# EAGLE design Cumulative_Testing_PCB1_01_Shreya (EAGLE 9.6.2)
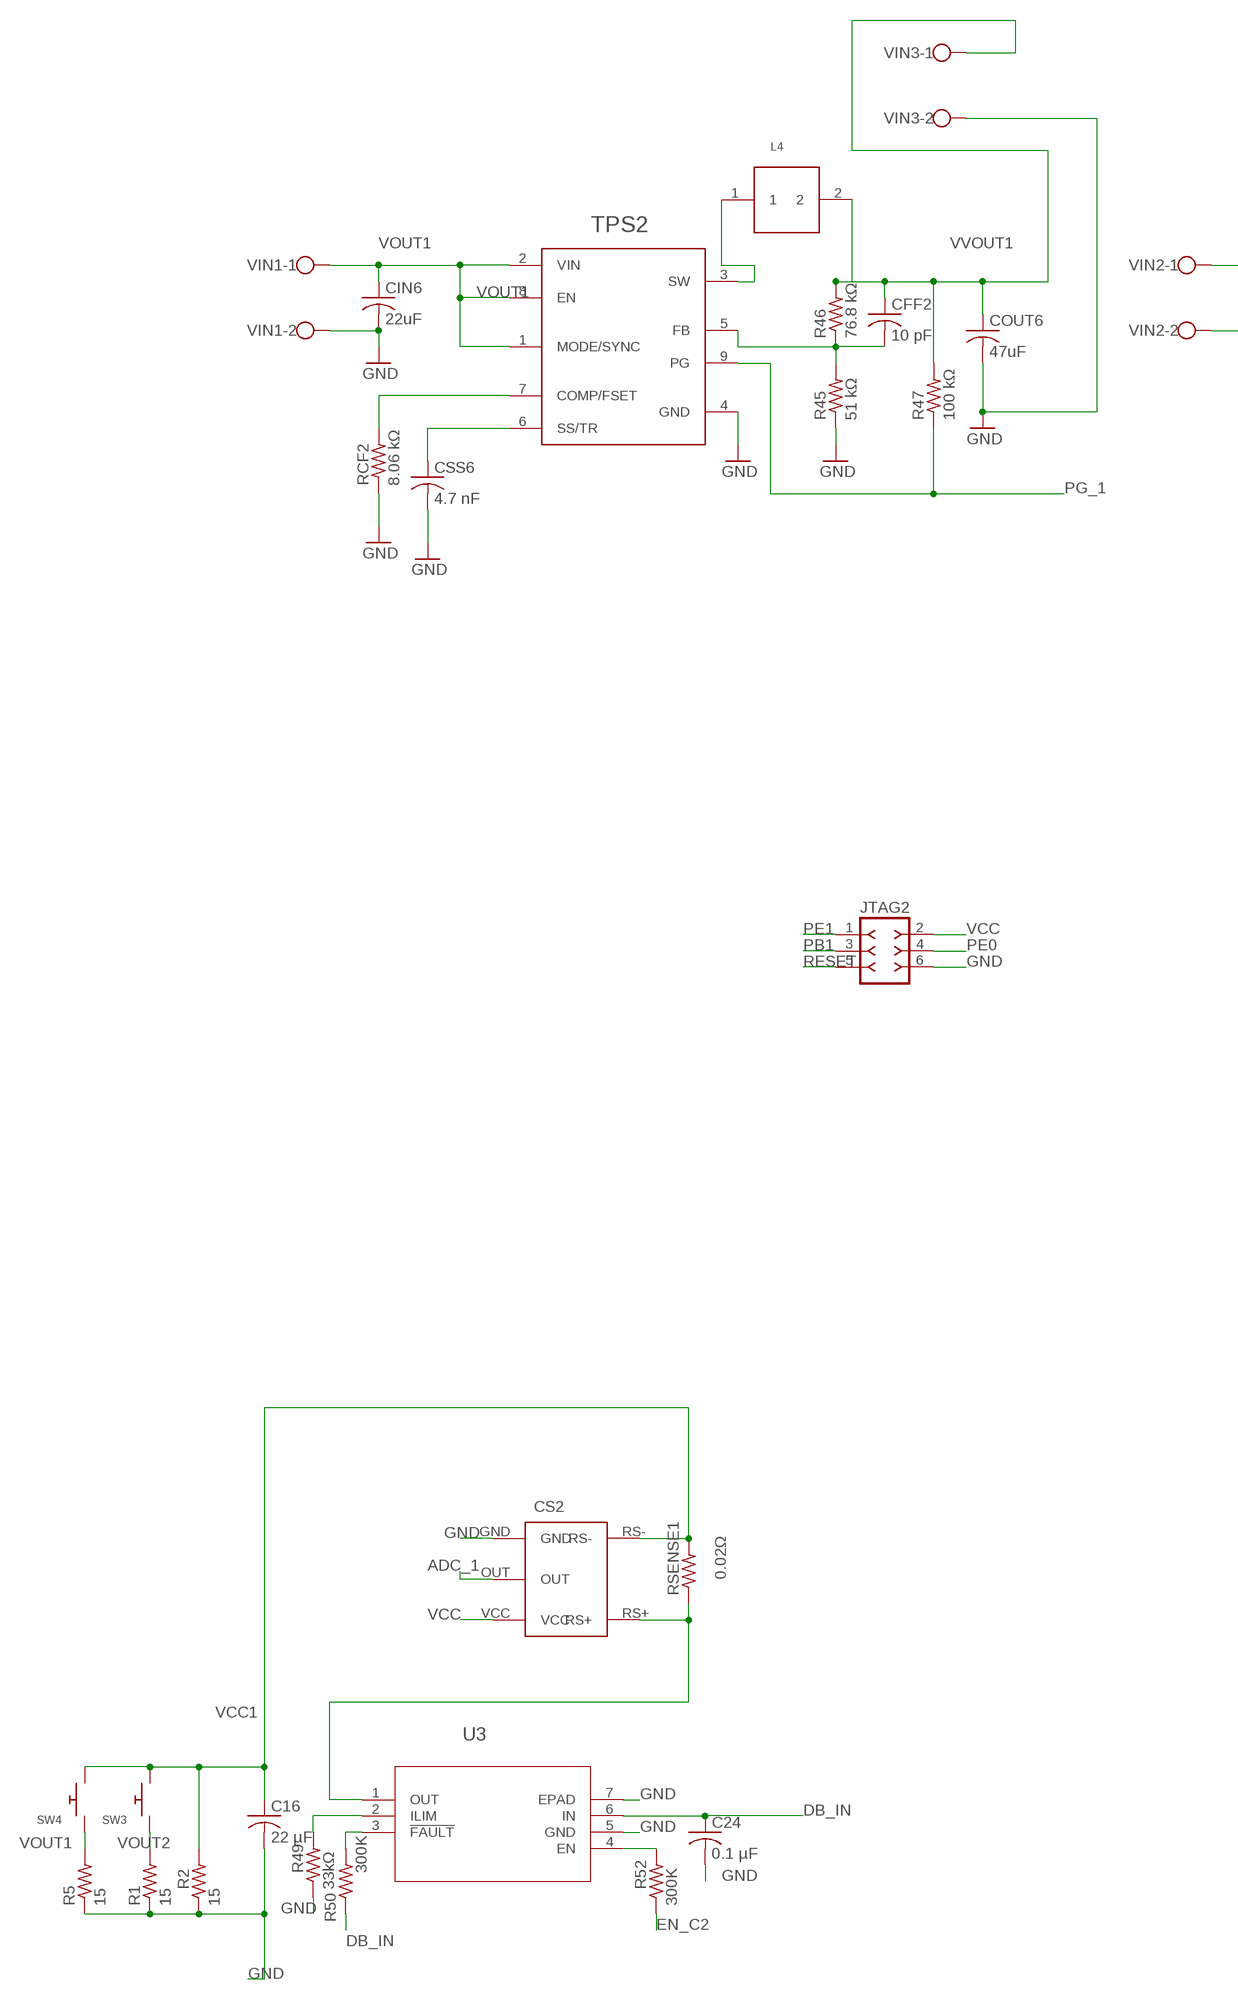
[diagram p0: schematic, sheet 1, part 1 of 2]
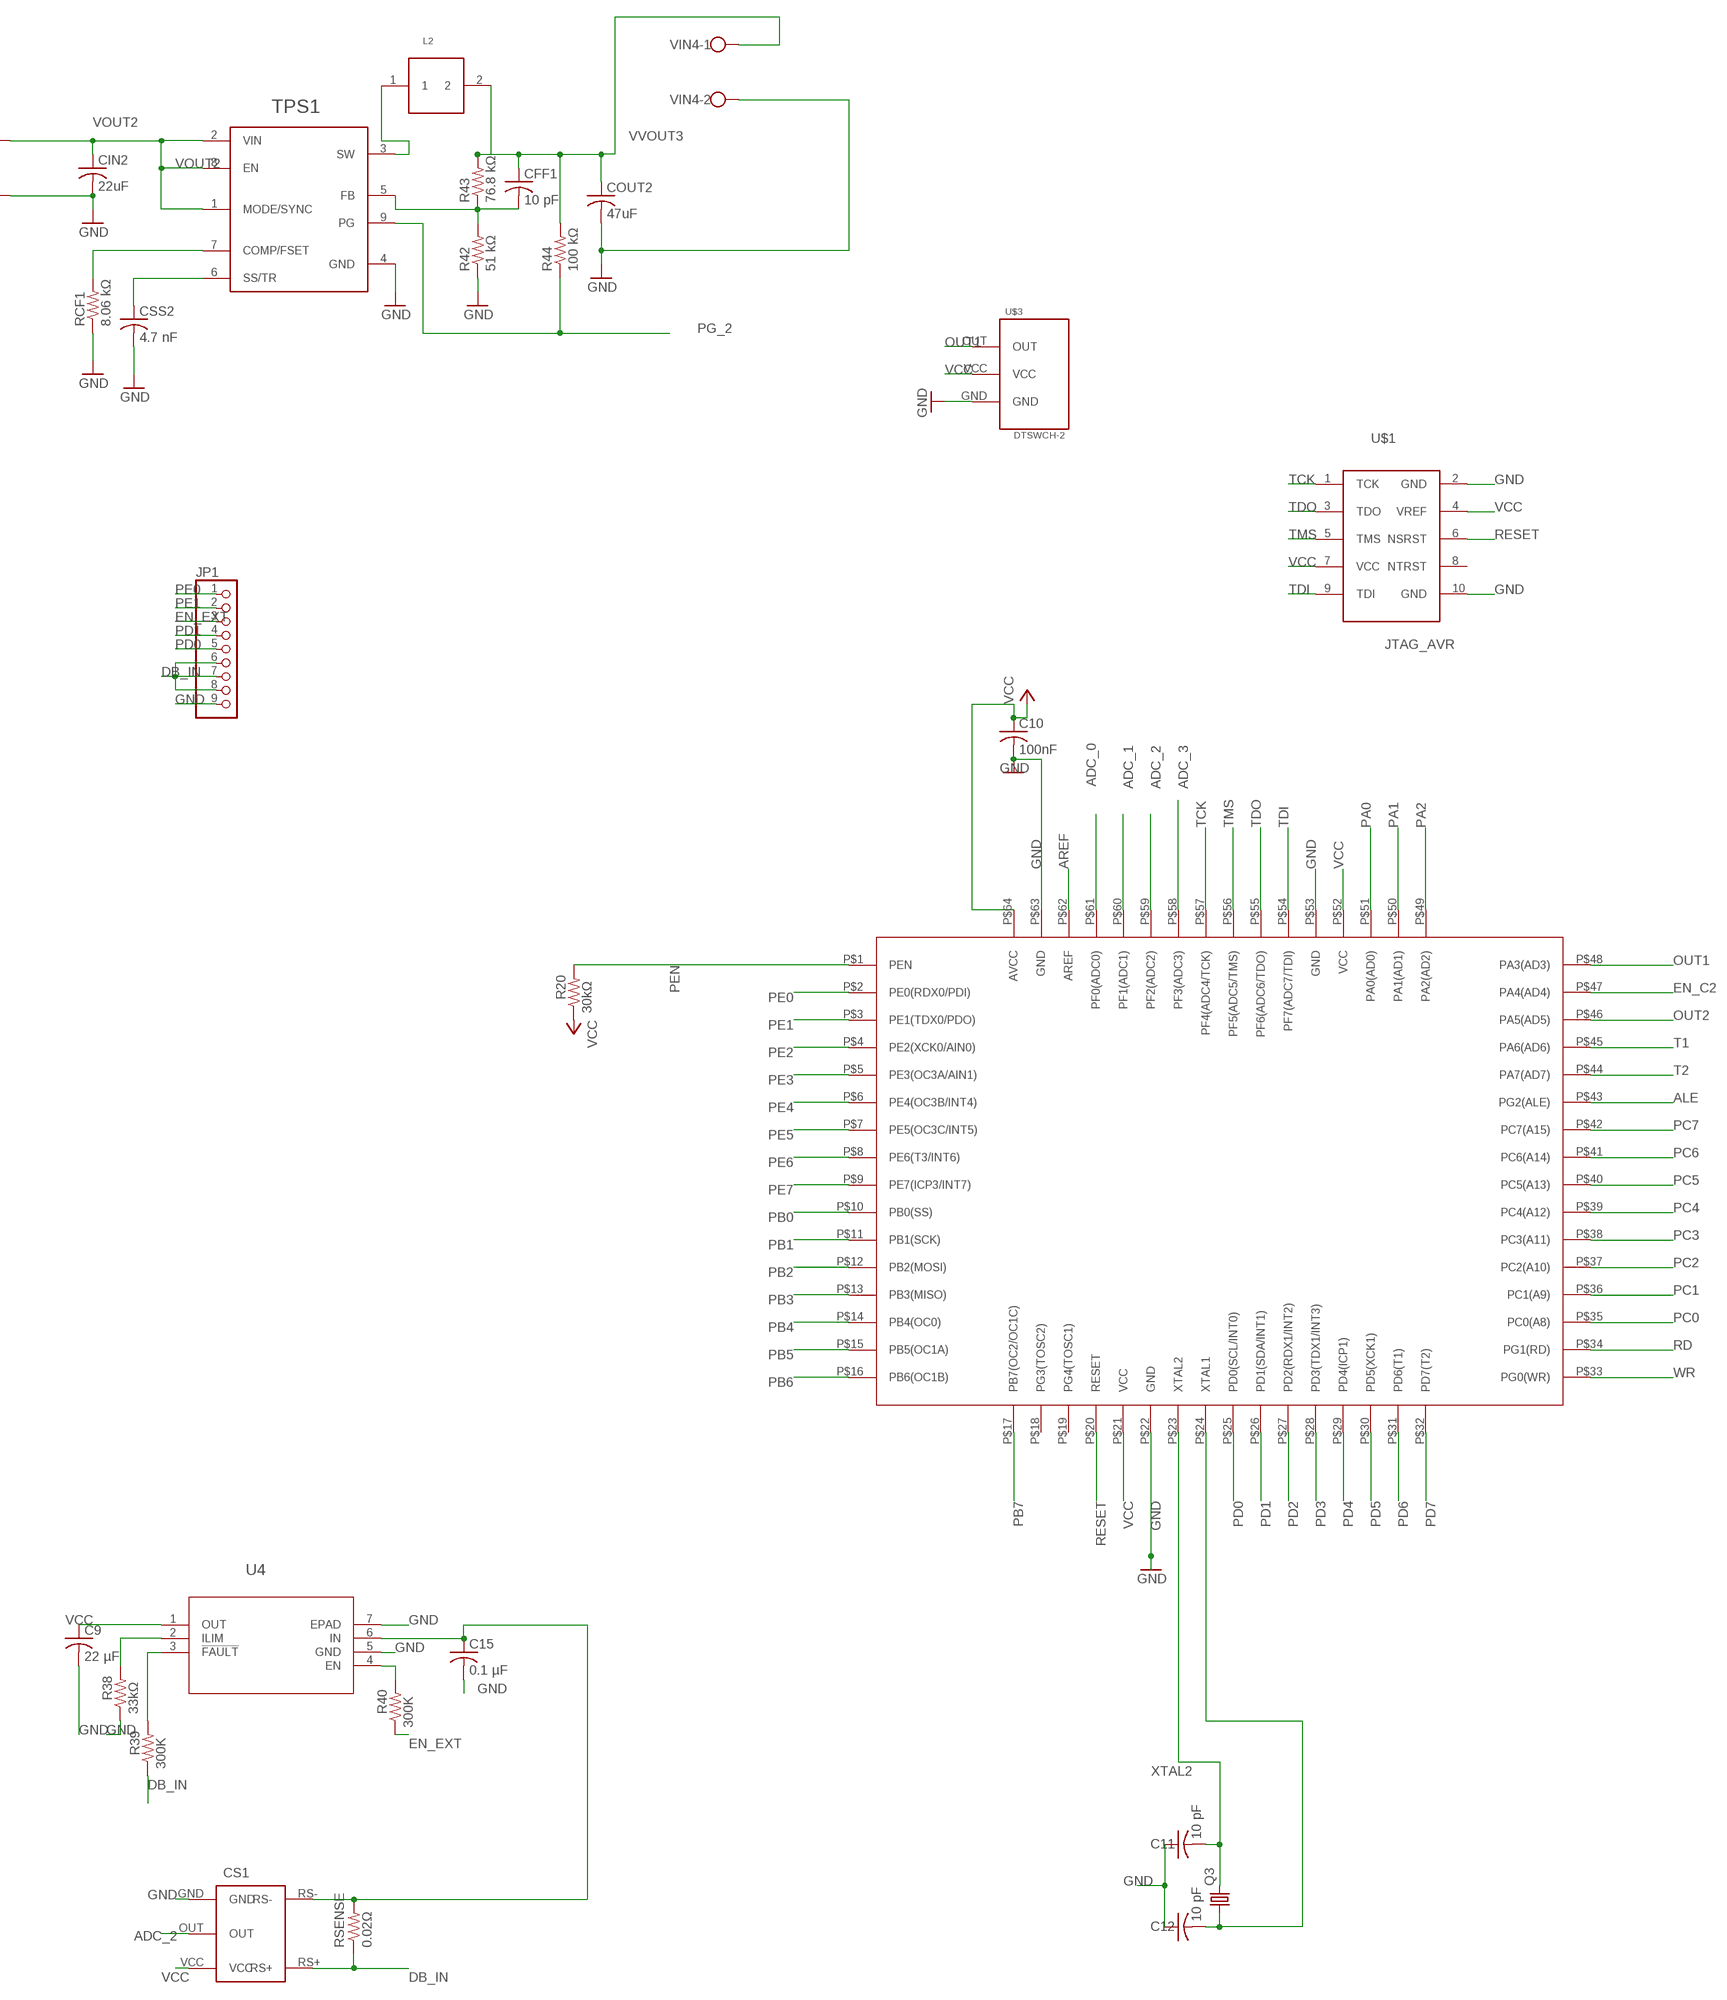
[diagram p1: schematic, sheet 1, part 2 of 2]

## Parts
ATMEGA128  ATMEGAS128  [ATMEGAS128]
C9  22 µF  C-USC0805  [C0805]
C10  100nF  C-USC0805  [C0805]
C11  10 pF  C-USC0805  [C0805]
C12  10 pF  C-USC0805  [C0805]
C15  0.1 µF  C-USC0805  [C0805]
C16  22 µF  C-USC0805  [C0805]
C24  0.1 µF  C-USC0805  [C0805]
CFF1  10 pF  C-USC0805  [C0805]
CFF2  10 pF  C-USC0805  [C0805]
CIN2  22uF  C-USC0805  [C0805]
CIN6  22uF  C-USC0805  [C0805]
COUT2  47uF  C-USC0805  [C0805]
COUT6  47uF  C-USC0805  [C0805]
CS1  MAX4372T  [MAX4372T]
CS2  MAX4372T  [MAX4372T]
CSS2  4.7 nF  C-USC0805  [C0805]
CSS6  4.7 nF  C-USC0805  [C0805]
JP1  PINHD-1X9  [1X09-BIG]
JTAG2  F-2X03-DIL-100  [DIL-100-2X03]
L2  0.56uH  XEL4020-561MEB  [XEL4020-561MEB]
L4  0.56uH  XEL4020-561MEB  [XEL4020-561MEB]
Q3  CRYSTALHC49U-V  [HC49U-V]
R1  15  R-US_R0805  [R0805]
R2  15  R-US_R0805  [R0805]
R5  15  R-US_R0805  [R0805]
R20  30kΩ  R-US_R0805  [R0805]
R38  33kΩ  R-US_R0805  [R0805]
R39  300K  R-US_R0805  [R0805]
R40  300K  R-US_R0805  [R0805]
R42  51 kΩ  R-US_R0805  [R0805]
R43  76.8 kΩ  R-US_R0805  [R0805]
R44  100 kΩ  R-US_R0805  [R0805]
R45  51 kΩ  R-US_R0805  [R0805]
R46  76.8 kΩ  R-US_R0805  [R0805]
R47  100 kΩ  R-US_R0805  [R0805]
R49  33kΩ  R-US_R0805  [R0805]
R50  300K  R-US_R0805  [R0805]
R52  300K  R-US_R0805  [R0805]
RCF1  8.06 kΩ  R-US_R0805  [R0805]
RCF2  8.06 kΩ  R-US_R0805  [R0805]
RSENSE  0.02Ω  R-US_R0805  [R0805]
RSENSE1  0.02Ω  R-US_R0805  [R0805]
SW3  SWITCH_PUSHBUTTONC&K_KSS  [BTN_CK_KSS]
SW4  SWITCH_PUSHBUTTONC&K_KSS  [BTN_CK_KSS]
TPS1  TPS62812  [TPS62812]
TPS2  TPS62812  [TPS62812]
U3  TPS25200DRVT_CURR_LIMIT  [DRV6_1X1P6]
U4  TPS25200DRVT_CURR_LIMIT  [DRV6_1X1P6]
U$1  JTAG_AVR  [JTAG_AVR]
U$3  DTSWCH-2  [DTSWCH-2]
VIN1  W237-102  [W237-102]
VIN2  W237-102  [W237-102]
VIN3  W237-102  [W237-102]
VIN4  W237-102  [W237-102]

## Nets
ADC_0: ATMEGA128.P$61(PF0(ADC0))
ADC_1: ATMEGA128.P$60(PF1(ADC1)) CS2.OUT
ADC_2: ATMEGA128.P$59(PF2(ADC2)) CS1.OUT
ADC_3: ATMEGA128.P$58(PF3(ADC3))
ALE: ATMEGA128.P$43(PG2(ALE))
AREF: ATMEGA128.P$62(AREF)
DB_IN: C24.1 CS1.RS+ JP1.6 JP1.7 JP1.8 R39.1 R50.1 RSENSE.1 U3.6(IN)
EN_C2: ATMEGA128.P$47(PA4(AD4)) R52.1
EN_EXT: JP1.3 R40.1
GND: ATMEGA128.P$22(GND) ATMEGA128.P$53(GND) ATMEGA128.P$63(GND) C9.2 C10.2 C11.1 C12.1 C15.2 C16.2 C24.2 CIN2.2 CIN6.2 COUT2.2 COUT6.2 CS1.GND CS2.GND CSS2.2 CSS6.2 JP1.9 JTAG2.6 R1.1 R2.1 R5.1 R38.1 R42.1 R45.1 R49.1 RCF1.1 RCF2.1 TPS1.4(GND) TPS2.4(GND) U3.5(GND) U3.7(EPAD) U4.5(GND) U4.7(EPAD) U$1.2(GND) U$1.10(GND) U$3.GND VIN1.2 VIN2.2 VIN3.2 VIN4.2
N$5: C15.1 CS1.RS- RSENSE.2 U4.6(IN)
N$6: CS2.RS+ RSENSE1.1 U3.1(OUT)
N$31: ATMEGA128.P$24(XTAL1) C12.2 Q3.1
N$70: CFF1.2 R42.2 R43.1 TPS1.5(FB)
N$71: L2.1 TPS1.3(SW)
N$72: RCF1.2 TPS1.7(COMP/FSET)
N$73: CSS2.1 TPS1.6(SS/TR)
N$74: CFF2.2 R45.2 R46.1 TPS2.5(FB)
N$75: L4.1 TPS2.3(SW)
N$76: RCF2.2 TPS2.7(COMP/FSET)
N$77: CSS6.1 TPS2.6(SS/TR)
N$102: R49.2 U3.2(ILIM)
N$103: R50.2 U3.3(!FAULT)
N$104: R52.2 U3.4(EN)
N$105: R38.2 U4.2(ILIM)
N$106: R40.2 U4.4(EN)
N$107: R39.2 U4.3(!FAULT)
OUT1: ATMEGA128.P$48(PA3(AD3)) U$3.OUT
OUT2: ATMEGA128.P$46(PA5(AD5))
PA0: ATMEGA128.P$51(PA0(AD0))
PA1: ATMEGA128.P$50(PA1(AD1))
PA2: ATMEGA128.P$49(PA2(AD2))
PB0: ATMEGA128.P$10(PB0(SS))
PB1: ATMEGA128.P$11(PB1(SCK)) JTAG2.3
PB2: ATMEGA128.P$12(PB2(MOSI))
PB3: ATMEGA128.P$13(PB3(MISO))
PB4: ATMEGA128.P$14(PB4(OC0))
PB5: ATMEGA128.P$15(PB5(OC1A))
PB6: ATMEGA128.P$16(PB6(OC1B))
PB7: ATMEGA128.P$17(PB7(OC2/OC1C))
PC0: ATMEGA128.P$35(PC0(A8))
PC1: ATMEGA128.P$36(PC1(A9))
PC2: ATMEGA128.P$37(PC2(A10))
PC3: ATMEGA128.P$38(PC3(A11))
PC4: ATMEGA128.P$39(PC4(A12))
PC5: ATMEGA128.P$40(PC5(A13))
PC6: ATMEGA128.P$41(PC6(A14))
PC7: ATMEGA128.P$42(PC7(A15))
PD0: ATMEGA128.P$25(PD0(SCL/INT0)) JP1.5
PD1: ATMEGA128.P$26(PD1(SDA/INT1)) JP1.4
PD2: ATMEGA128.P$27(PD2(RDX1/INT2))
PD3: ATMEGA128.P$28(PD3(TDX1/INT3))
PD4: ATMEGA128.P$29(PD4(ICP1))
PD5: ATMEGA128.P$30(PD5(XCK1))
PD6: ATMEGA128.P$31(PD6(T1))
PD7: ATMEGA128.P$32(PD7(T2))
PE0: ATMEGA128.P$2(PE0(RDX0/PDI)) JP1.1 JTAG2.4
PE1: ATMEGA128.P$3(PE1(TDX0/PDO)) JP1.2 JTAG2.1
PE2: ATMEGA128.P$4(PE2(XCK0/AIN0))
PE3: ATMEGA128.P$5(PE3(OC3A/AIN1))
PE4: ATMEGA128.P$6(PE4(OC3B/INT4))
PE5: ATMEGA128.P$7(PE5(OC3C/INT5))
PE6: ATMEGA128.P$8(PE6(T3/INT6))
PE7: ATMEGA128.P$9(PE7(ICP3/INT7))
PEN: ATMEGA128.P$1(PEN) R20.2
PG_1: R47.1 TPS2.9(PG)
PG_2: R44.1 TPS1.9(PG)
RD: ATMEGA128.P$34(PG1(RD))
RESET: ATMEGA128.P$20(RESET) JTAG2.5 U$1.6(NSRST)
T1: ATMEGA128.P$45(PA6(AD6))
T2: ATMEGA128.P$44(PA7(AD7))
TCK: ATMEGA128.P$57(PF4(ADC4/TCK)) U$1.1(TCK)
TDI: ATMEGA128.P$54(PF7(ADC7/TDI)) U$1.9(TDI)
TDO: ATMEGA128.P$55(PF6(ADC6/TDO)) U$1.3(TDO)
TMS: ATMEGA128.P$56(PF5(ADC5/TMS)) U$1.5(TMS)
VCC: ATMEGA128.P$21(VCC) ATMEGA128.P$52(VCC) ATMEGA128.P$64(AVCC) C9.1 C10.1 CS1.VCC CS2.VCC JTAG2.2 R20.1 U4.1(OUT) U$1.4(VREF) U$1.7(VCC) U$3.VCC
VCC1: C16.1 CS2.RS- R2.2 RSENSE1.2 SW3.P$2 SW4.P$2
VOUT1: CIN6.1 R5.2 SW4.P$1 TPS2.1(MODE/SYNC) TPS2.2(VIN) TPS2.8(EN) VIN1.1
VOUT2: CIN2.1 R1.2 SW3.P$1 TPS1.1(MODE/SYNC) TPS1.2(VIN) TPS1.8(EN)
VOUT3: VIN2.1
VVOUT1: CFF2.1 COUT6.1 L4.2 R46.2 R47.2 VIN3.1
VVOUT3: CFF1.1 COUT2.1 L2.2 R43.2 R44.2 VIN4.1
WR: ATMEGA128.P$33(PG0(WR))
XTAL2: ATMEGA128.P$23(XTAL2) C11.2 Q3.2
Unconnected: ATMEGA128.P$18(PG3(TOSC2)) ATMEGA128.P$19(PG4(TOSC1)) U$1.8(NTRST)

## Library data of the parts
ATMEGA128 = AtxMegaS128:ATMEGAS128
C9-C12 C15 C16 C24 = adafruit:C-US: CAPACITOR, American symbol
CFF1 CFF2 CIN2 CIN6 COUT2 COUT6 CSS2 CSS6 = rcl:C-US: CAPACITOR, American symbol; SPICEPREFIX: C
CS1 CS2 = ADS_comp:MAX4372T
JP1 = adafruit:PINHD-1X9: Pin header 1x10 0.1" spacing With round pins
JTAG2 = con-headers-jp:F-2X03-: FEMALE HEADER
L2 L4 = XEL4020-561MEB (INDUCTOR):XEL4020-561MEB: Shielded Power Inductor XEL4020 • Extremely low DCR and ultra low AC losses for high switching frequencies (2 to 5 MHz) • AEC-Q200 Grade 1 qualified (–40°C to +125°C ambient) • Superior current handling with soft saturation characteristics • Can withstand high current spike
Q3 = crystal:CRYSTAL: CRYSTAL; OC_FARNELL: 1666969; OC_NEWARK: unknown
R1 R2 R5 R20 R38-R40 R42-R47 R49 R50 R52 RCF1 RCF2 RSENSE RSENSE1 = adafruit:R-US_: RESISTOR, American symbol
SW3 SW4 = adafruit:SWITCH_PUSHBUTTON: Buttons SOFTTOUCHSMD_SJ - Soft touch temporary push button (Super Junk Akihabara) Compatible with SKPMANE010 [Mouser: 688-SKPMAN] C&K_KSS = Digikey: KSS221GLFS
TPS1 TPS2 = TPS62812:TPS62812: TPS6281x-Q1 2.75-V to 6-V Adjustable-Frequency Step-Down Converter 1. Features • AEC-Q100 qualified for automotive applications – Device temperature grade 1: –40°C to +125°C TA • Input voltage range: 2.75 V to 6 V • Family of 1 A, 2 A, 3 A and 4 A • Quiescent current 15-µA typical • Output voltage from 0.6 V to 5.5 V • Output voltage accuracy ±1% (PWM operation) • Adjustable soft-start • Forced PWM or PWM and PFM operation • Adjustable switching frequency of 1.8 MHz to 4 MHz • Precise ENABLE input allows – User-defined undervoltage lockout – Exact sequencing • 100% duty cycle mode • Active output discharge • Spread spectrum clocking - optional • Fold-back overcurrent protection - optional • Power good output with window comparator • Package with wettable flanks
U3 U4 = Advitiy:TPS25200DRVT_CURR_LIMIT; MANUFACTURER_PART_NUMBER: TPS25200DRVT; VENDOR: Texas Instruments
U$1 = JTAG_AVR:JTAG_AVR
U$3 = ADS_01:DTSWCH-2
VIN1-VIN4 = con-wago-500:W237-102: WAGO SCREW CLAMP; MPN: 237-102; OC_FARNELL: unknown; OC_NEWARK: 70K9898

## Board
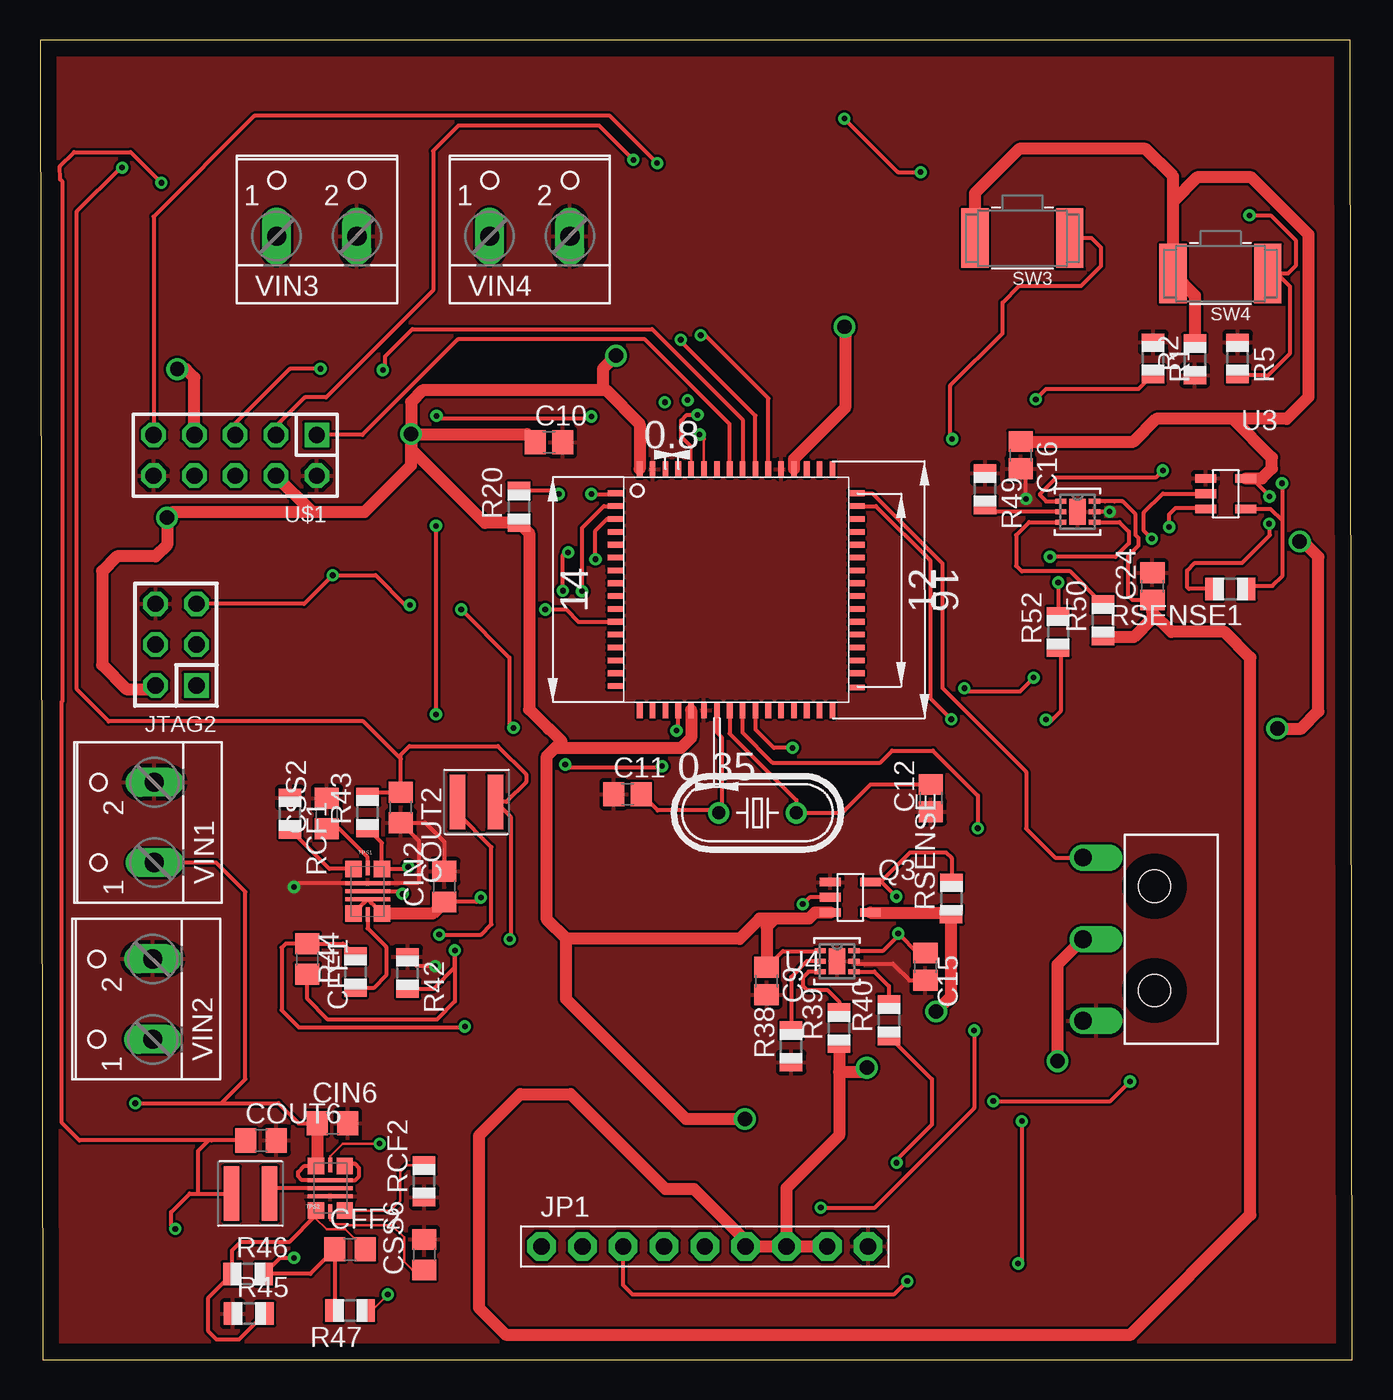
[diagram p2: board, top side]
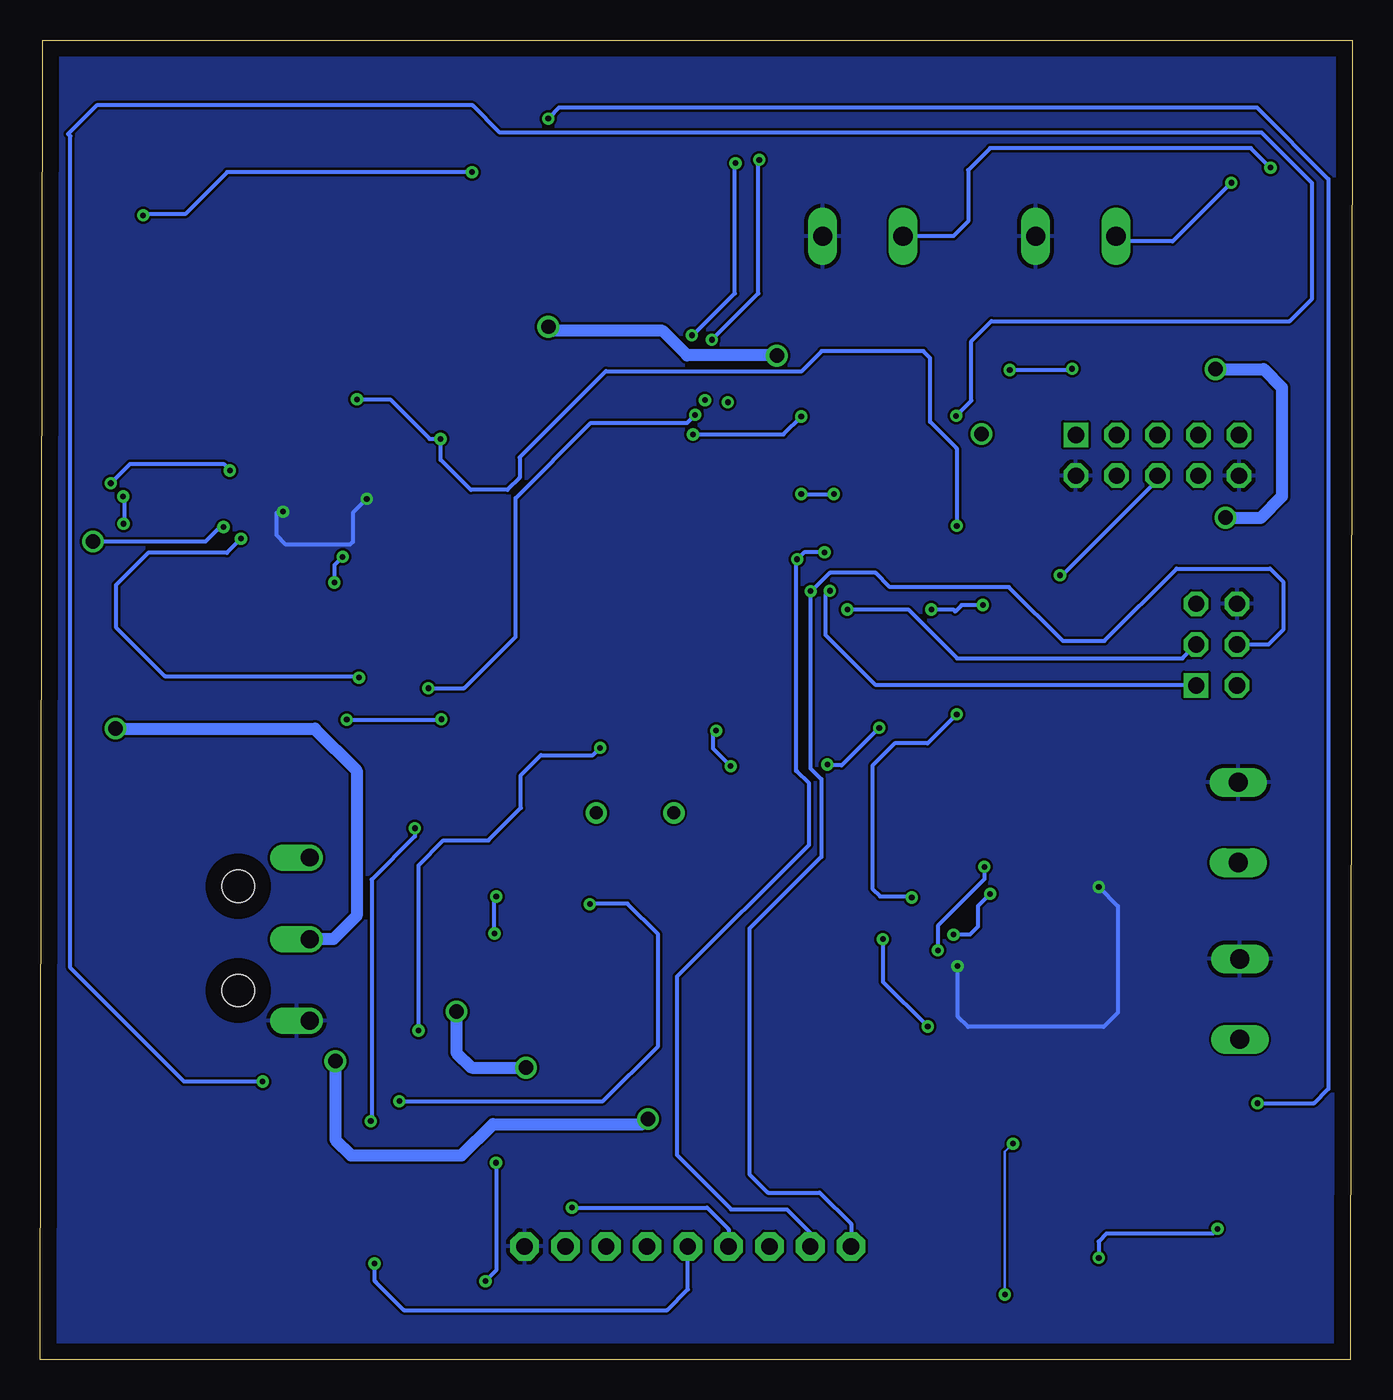
[diagram p3: board, bottom side, seen from below]

Size 81.7 x 82.15 mm. Coordinates in mm from the lower left corner, seen from the top.
Outline: 0.15,0 81.7,0 81.54,82.15 0,82.15 0.15,0
Copper layers (1*16): Top 0.035mm / dielectric 1.5mm / Bottom 0.035mm
Design rules "default": minimum track width 6mil, minimum drill 0.35mm, track to track 6mil, track to pad 6mil, pad to pad 6mil, via to via 6mil, smd to smd 6mil, copper to edge 40mil, drill to drill 6mil, minimum pad ring 10mil, minimum via ring 8mil, stop-mask expansion 4mil, vias tented up to drill 0mil, thermal gap 10mil

### Footprints (pad centres in the part's own frame; a part is rotated, then mirrored left to right if it is on the bottom)
ATMEGAS128 = smd 1 x 0.35: P$1 -0.5,13; P$2 -0.5,12.2; P$3 -0.5,11.4; P$4 -0.5,10.6; P$5 -0.5,9.8; P$6 -0.5,9; P$7 -0.5,8.2; P$8 -0.5,7.4; P$9 -0.5,6.6; P$10 -0.5,5.8; P$11 -0.5,5; P$12 -0.5,4.2; P$13 -0.5,3.4; P$14 -0.5,2.6; P$15 -0.5,1.8; P$16 -0.5,1; P$33 14.5,0.9; P$34 14.5,1.8; P$35 14.5,2.6; P$36 14.5,3.4; P$37 14.5,4.2; P$38 14.5,5; P$39 14.5,5.8; P$40 14.5,6.6; P$41 14.5,7.4; P$42 14.5,8.2; P$43 14.5,9; P$44 14.5,9.8; P$45 14.5,10.6; P$46 14.5,11.4; P$47 14.5,12.2; P$48 14.5,13 | smd 0.35 x 1: P$17 1,-0.5; P$18 1.8,-0.5; P$19 2.6,-0.5; P$20 3.4,-0.5; P$21 4.2,-0.5; P$22 5,-0.5; P$23 5.8,-0.5; P$24 6.6,-0.5; P$25 7.4,-0.5; P$26 8.2,-0.5; P$27 9,-0.5; P$28 9.8,-0.5; P$29 10.6,-0.5; P$30 11.4,-0.5; P$31 12.2,-0.511; P$32 13,-0.5; P$49 13,14.5; P$50 12.2,14.5; P$51 11.4,14.5; P$52 10.6,14.5; P$53 9.8,14.5; P$54 9,14.5; P$55 8.2,14.5; P$56 7.4,14.5; P$57 6.6,14.5; P$58 5.8,14.5; P$59 5,14.5; P$60 4.2,14.5; P$61 3.4,14.5; P$62 2.6,14.5; P$63 1.8,14.5; P$64 1,14.5
C0805 = smd 1.3 x 1.5: 1 -0.85,0; 2 0.85,0
C0805' = smd 1.3 x 1.5: 1 -0.95,0; 2 0.95,0
MAX4372T = smd 1.3 x 0.55: GND -1.25,0.95; OUT -1.25,0; RS+ 1.25,-0.95; RS- 1.25,0.95; VCC -1.25,-0.95
1X09-BIG = drill 1.016 pad 1.778 octagon: 1 -10.16,0; 2 -7.62,0; 3 -5.08,0; 4 -2.54,0; 5 0,0; 6 2.54,0; 7 5.08,0; 8 7.62,0; 9 10.16,0
DIL-100-2X03 = drill 1.016 square: 1 -2.54,-1.27 | drill 1.016 octagon: 2 -2.54,1.27; 3 0,-1.27; 4 0,1.27; 5 2.54,-1.27; 6 2.54,1.27
XEL4020-561MEB = smd 0.98 x 3.4: 1 -1.185,0; 2 1.185,0
HC49U-V = drill 0.813: 1 -2.413,0; 2 2.413,0
R0805 = smd 1.1 x 1.4: 1 -1,0; 2 1,0
BTN_CK_KSS = smd 1.7 x 3.7: P$1 -2.95,0; P$2 2.95,0
TPS62812 = smd 1.025 x 1.025: 1 0.887,-1.387; 5 0.887,1.387; 7 -0.887,1.387; 8 -0.887,-1.387 | smd 2.8 x 0.25: 2 0,-0.5; 3 0,0; 4 0,0.5 | smd 0.25 x 0.9: 6 0,1.45; 9 0,-1.45
DRV6_1X1P6 = smd 0.7 x 0.3: 1 -1.05,0.65; 2 -1.05,0; 3 -1.05,-0.65; 4 1.05,-0.65; 5 1.05,0; 6 1.05,0.65 | smd 1.016 x 1.6: 7 0,0
JTAG_AVR = drill 1.016 square: 1 -5.08,-1.27 | drill 1.016 octagon: 2 -5.08,1.27; 3 -2.54,-1.27; 4 -2.54,1.27; 5 0,-1.27; 6 0,1.27; 7 2.54,-1.27; 8 2.54,1.27; 9 5.08,-1.27; 10 5.08,1.27
DTSWCH-2 = drill 1.1 offset: GND -5.5,-5.08; OUT -5.5,5.08; VCC -5.5,0 | hole 2: -1.04,-3.2; -1.04,3.3
W237-102 = drill 1.194 long: 1 -2.5,-1.27; 2 2.5,-1.27

### Placement (x,y rotation side)
ATMEGA128  36.33,40.94 0 top
C9  45.22,23.58 270 top
C10  31.68,57.12 0 top
C11  36.57,35.22 0 top
C12  55.45,34.97 90 top
C15  55.11,24.48 270 top
C16  61.04,56.32 270 top
C24  69.24,48.15 90 top
CFF1  10 pF  [C0805']  16.63,24.96 270 top
CFF2  10 pF  [C0805']  19.29,6.87 0 top
CIN2  22uF  [C0805']  25.16,29.45 90 top
CIN6  22uF  [C0805']  18.2,14.72 0 top
COUT2  47uF  [C0805']  22.46,34.39 270 top
COUT6  47uF  [C0805']  13.76,13.66 0 top
CS1  50.44,28.79 0 top
CS2  73.8,53.92 0 top
CSS2  4.7 nF  [C0805']  17.85,34 90 top
CSS6  4.7 nF  [C0805']  23.9,6.54 90 top
JP1  41.38,7.06 0 top
JTAG2  8.46,44.53 90 top
L2  27.17,34.74 0 top
L4  13.09,10.35 180 top
Q3  44.66,34.05 180 top
R1  69.29,62.34 270 top
R2  71.88,62.28 90 top
R5  74.55,62.34 270 top
R20  29.8,53.1 90 top
R38  46.74,19.52 90 top
R39  49.73,20.65 90 top
R40  52.84,21.15 90 top
R42  22.88,24.08 270 top
R43  20.39,34.08 90 top
R44  19.62,24.15 90 top
R45  12.99,2.87 0 top
R46  12.94,5.35 0 top
R47  19.29,3.06 180 top
R49  58.83,54.2 270 top
R50  66.16,46.05 90 top
R52  63.38,45.3 90 top
RCF1  15.56,34 270 top
RCF2  23.9,11.12 90 top
RSENSE  56.72,28.73 89.5 top
RSENSE1  74.09,48 180 top
SW3  61.14,69.82 180 top
SW4  73.48,67.61 180 top
TPS1  20.39,29.17 0 top
TPS2  18.07,10.68 180 top
U3  64.58,52.8 0 top
U4  49.61,24.82 0 top
U$1  12.14,56.31 180 top
U$3  70.41,26.19 0 top
VIN1  5.84,33.46 90 top
VIN2  5.74,22.45 90 top
VIN3  17.22,71.22 0 top
VIN4  30.48,71.22 0 top

### Tracks (layer width: path | path; a pad name or v marks a point on that pad's centre or on a via)
ADC_1  (via drill 0.35)
  Top 0.152: 40.53,56.83 ATMEGA128.P$60
  Top 0.254: v69.2,51.12 68.71,51.61 68.71,52.75 69.89,53.92 CS2.OUT | v61.85,42.47 60.99,41.6 57.73,41.6 v57.53,41.81 | v40.92,58.83 40.26,58.83 39.9,58.47 39.9,57.45 40.53,56.83
  Bottom 0.254: v69.2,51.12 70.08,50.24 74.98,50.24 76.99,48.23 76.99,45.62 73.94,42.57 61.95,42.57 v61.85,42.47 | v57.53,41.81 55.3,41.81 52.1,45.01 52.1,53.65 47.42,58.32 41.43,58.32 v40.92,58.83
ADC_2  (via drill 0.35)
  Top 0.152: 41.33,57.34 ATMEGA128.P$59
  Top 0.254: CS1.OUT 47.89,28.79 v47.47,28.37 | v67.84,17.32 66.62,16.1 v59.33,16.1 | v24.67,58.76 24.85,58.58 34.17,58.58 v34.32,58.73 | 41.33,57.34 v41.06,57.61
  Bottom 0.254: v59.33,16.1 46.66,16.1 43.23,19.53 43.23,26.49 45.14,28.4 47.45,28.4 v47.47,28.37 | v67.84,17.32 72.74,17.32 79.82,24.41 79.82,76.19 79.95,76.32 78.17,78.1 54.78,78.1 53.08,76.39 5.66,76.39 2.51,73.25 2.51,66.06 3.91,64.67 22.48,64.67 23.72,63.42 23.72,59.71 v24.67,58.76 | v41.06,57.61 35.43,57.61 v34.32,58.73
DB_IN  (via drill 0.9)
  Top 0.254: C24.1 68.02,47.3 67.74,47.57 67.74,50.06 68.38,50.7 68.38,51.16 68.2,51.33 68.2,52.63 67.39,53.44 66.87,53.44 66.85,53.46 66.31,53.46 66.29,53.45 U3.6
  Top 0.762: R39.1 49.73,17.9 | 49.73,17.9 49.73,13.97 46.46,10.69 JP1.7 | v51.46,18.19 51.18,17.9 49.73,17.9 | JP1.7 JP1.6 43.92,7.42 40.69,10.64 38.91,10.64 33.02,16.54 29.9,16.54 27.3,13.95 27.3,3.25 28.98,1.57 67.89,1.57 75.34,9.02 75.34,43.71 73.74,45.31 70.43,45.31 69.24,46.5 C24.1 69.24,46.16 68.07,44.98 66.22,44.98 R50.1 | JP1.7 JP1.8 | v55.78,21.69 56.72,22.63 RSENSE.1 56.6,27.84 CS1.RS+
  Bottom 0.762: v55.78,21.69 55.78,19.13 54.84,18.19 v51.46,18.19
EN_C2  (via drill 0.35)
  Top 0.254: ATMEGA128.P$47 52.02,53.15 55.4,49.77 55.4,41.2 v56.72,39.88 | R52.1 63.53,44.16 63.53,40.36 62.89,39.73 62.74,39.73 v62.61,39.85
  Bottom 0.254: v62.61,39.85 56.74,39.85 v56.72,39.88
EN_EXT  (via drill 0.35)
  Top 0.254: R40.1 55.51,17.48 55.51,14.64 53.31,12.45 v53.31,12.27 | v53.97,4.9 53.14,4.06 36.88,4.06 36.3,4.65 JP1.3
  Bottom 0.254: v53.97,4.9 53.31,5.56 v53.31,12.27
GND  (via drill 0.35)
  Top 0.254: CIN2.2 25.16,32.24 23.96,33.45 COUT2.2 23.57,32.33 23.57,29.77 23.48,29.68 TPS1.4 16.11,29.68 15.87,29.44 v15.8,29.44 | v24.59,24.51 23.45,24.51 R42.1 | C16.2 61.32,55.19 61.32,53.59 v61.37,53.59 | v66.58,52.81 66.57,52.8 U3.5 | U4.5 50.82,24.66 53.09,24.66 54.12,23.62 C15.2
  Bottom 0.254: v15.8,29.44 14.6,28.25 14.6,21.61 15.49,20.73 23.93,20.73 24.56,21.36 24.56,24.49 v24.59,24.51 | v61.37,53.59 62.23,52.73 62.23,50.93 62.41,50.75 66.4,50.75 66.98,51.33 66.98,52.73 66.9,52.81 v66.58,52.81
  pour Top (rank 2): -1.8,83.06 84.07,83.06 88.57,78.56 88.57,1.91 85.14,-1.52 -0.28,-1.52 -1.8,0
  pour Bottom (rank 2): -1.3,85.09 85.09,85.09 90.68,79.5 90.68,0.64 87.5,-2.54 -1.8,-2.54 -3.84,-0.51 -3.84,82.55
N$3  (via drill 0.35)
  other vias: 38.89,59.61
N$4  (via drill 0.35)
  other vias: 40.31,59.74
N$5  (via drill 0.35)
  Top 0.254: CS1.RS- 52.3,29.74 | 52.3,29.74 54.15,31.6 56.39,31.6 56.73,31.25 RSENSE.2 | U4.6 52.49,25.47 53.42,26.39 v53.42,26.54 54.63,25.32 C15.1 | v53.3,28.84 52.4,29.74 52.3,29.74
  Bottom 0.254: v53.42,26.54 53.42,28.7 v53.29,28.83 v53.3,28.84
N$6  (via drill 0.35)
  Top 0.254: RSENSE1.1 75.28,48.18 76.71,48.18 77.34,48.82 77.34,51.89 77.34,52.22 | CS2.RS+ 76.6,52.97 77.34,52.22 | 77.34,52.22 77.34,54.46 77.27,54.53 v77.3,54.57 | v69.89,55.36 69.44,54.91 63.25,54.91 62.23,53.9 62.23,53.85 62.63,53.45 U3.1
  Bottom 0.254: v77.3,54.57 76.1,55.78 70.28,55.78 69.88,55.37 v69.89,55.36
N$31
  Top 0.254: C12.2 51.69,35.82 49.92,34.05 Q3.1 47.07,34.84 42.93,38.99 ATMEGA128.P$24
N$70  (via drill 0.35)
  Top 0.254: v22.91,30.69 22.78,30.56 TPS1.5 21.27,32.19 R43.1 | R42.2 24.47,23.08 25.81,24.43 v25.81,25.49 25.81,22.31 24.69,21.18 17.91,21.18 16.63,22.46 CFF1.2
  Bottom 0.254: v22.91,30.69 22.91,29.92 25.81,27.02 v25.81,25.49
N$71  (via drill 0.35)
  Top 0.254: TPS1.3 22.39,29.18 v22.56,29.01 | v24.84,26.47 27.46,26.47 28.09,27.1 28.09,31.92 25.98,34.03 L2.1
  Bottom 0.254: v22.56,29.01 23.32,28.25 23.32,26.98 23.83,26.47 v24.84,26.47
N$72
  Top 0.254: TPS1.7 18,30.56 RCF1.2
N$73
  Top 0.254: CSS2.1 18.61,33.05 20.39,31.27 TPS1.6
N$74
  Top 0.152: CFF2.2 18.99,8.13 17.83,8.13 17.14,8.82 17.14,9.14
  Top 0.254: R45.2 12.39,1.27 10.97,1.27 10.46,1.78 10.46,3.87 R46.1 11.94,6.81 12.5,7.37 15.54,7.37 17.14,8.96 17.14,9.14 17.19,9.2 TPS2.5
N$75
  Top 0.254: L4.1 14.61,10.68 TPS2.3
N$76
  Top 0.152: TPS2.7 21.79,9.3 22.4,9.91 22.4,11.68 22.83,12.12 RCF2.2
N$77
  Top 0.152: TPS2.6 18.07,8.7 18.34,8.43 19.11,8.43 19.17,8.38 21.89,8.38 22.66,7.62 22.66,6.1 23.16,5.59 CSS6.1
N$102
  Top 0.254: R49.2 59.23,52.8 U3.2
N$103
  Top 0.254: U3.3 61.57,52.15 60.76,51.33 60.76,49.43 61.11,49.08 64.13,49.08 R50.2
N$104  (via drill 0.35)
  Top 0.254: U3.4 67.18,52.15 67.77,51.56 67.77,50.83 66.93,49.99 v62.86,49.99 | v63.38,48.39 R52.2
  Bottom 0.254: v62.86,49.99 63.38,49.48 v63.38,48.39
N$105
  Top 0.254: U4.2 47.73,24.82 46.74,23.83 R38.2
N$106
  Top 0.254: U4.4 51.93,24.17 52.84,23.26 R40.2
N$107
  Top 0.254: U4.3 47.84,24.17 47.47,23.8 47.47,23.29 47.73,23.04 49,23.04 49.73,22.3 R39.2
OUT1
  Top 0.254: ATMEGA128.P$48 51.8,53.95 56.16,49.58 56.16,41.83 61.38,36.6 61.38,33.07 63.19,31.27 U$3.OUT
PB1  (via drill 0.35)
  Top 0.254: v31.45,46.71 32.74,46.71 33.51,45.95 ATMEGA128.P$11
  Bottom 0.254: v31.45,46.71 27.66,46.71 24.61,43.66 10.59,43.66 JTAG2.3
PD0  (via drill 0.35)
  Top 0.254: v58.37,33.1 58.37,35.13 55.58,37.92 53.04,37.92 52.3,37.19 45.59,37.19 43.73,39.05 ATMEGA128.P$25 | v61.11,14.86 61.11,6.15 60.96,5.99 v60.88,5.99
  Bottom 0.254: v58.37,33.1 58.37,32.59 61.06,29.9 61.06,14.91 v61.11,14.86 | JP1.5 41.38,4.39 42.67,3.1 59.05,3.1 60.79,4.84 60.83,4.88 60.88,4.93 v60.88,5.99
PD1  (via drill 0.35)
  Top 0.254: v58.14,20.5 58.14,15.67 51.92,9.45 48.67,9.45 48.62,9.5 v48.59,9.47 | v46.84,38.1 45.67,38.1 44.53,39.24 ATMEGA128.P$26
  Bottom 0.254: v58.14,20.5 58.14,30.79 56.59,32.33 53.8,32.33 51.77,34.37 51.77,36.4 50.52,37.64 47.29,37.64 v46.84,38.1 | v48.59,9.47 40.18,9.47 38.84,8.13 JP1.4
PE0  (via drill 0.35)
  Top 0.254: v33.73,47.85 33.73,51.79 35.09,53.15 ATMEGA128.P$2
  Bottom 0.254: JP1.1 31.22,8.46 33.17,10.41 36.4,10.41 37.54,11.56 37.54,26.85 33.07,31.32 33.07,36.14 33.73,36.8 v33.73,47.85 33.68,47.85 32.54,49 29.69,49 28.8,48.11 21.39,48.11 18.03,44.76 15.44,44.76 10.95,49.25 5.13,49.25 4.32,48.44 4.32,45.44 5.23,44.53 JTAG2.4
PE1  (via drill 0.35)
  Top 0.254: v34.57,49.84 34.57,51.61 35.3,52.34 ATMEGA128.P$3 | v32.54,47.88 32.54,50.09 32.72,50.27 v32.87,50.27
  Bottom 0.254: v32.54,47.88 32.82,47.6 32.82,45.14 29.72,42.04 9.78,42.04 JTAG2.1 | v32.87,50.27 34.14,50.27 v34.57,49.84 34.65,49.76 34.65,36.65 34.59,36.65 33.83,35.89 33.83,32.08 42.06,23.85 42.06,12.75 38.68,9.37 35.2,9.37 33.76,7.92 JP1.2
PEN  (via drill 0.35)
  Top 0.254: ATMEGA128.P$1 35.78,53.9 v34.32,53.9 | v32.28,53.9 32.08,54.1 R20.2
  Bottom 0.254: v34.32,53.9 v32.28,53.9
PG_1  (via drill 0.35)
  Top 0.152: R47.1 20.64,3.06 v21.64,4.06 | v21.13,13.46 18.85,13.46 18.07,12.69 TPS2.9
  Bottom 0.152: v21.64,4.06 21.64,12.95 v21.13,13.46
PG_2
  Top 0.254: TPS1.9 20.39,26.86 21.54,25.7 21.54,23.93 20.76,23.15 R44.1
RESET  (via drill 0.35)
  Top 0.254: v26.21,46.71 29.21,43.71 29.21,39.6 v29.46,39.34 | v38.71,36.96 38.61,36.85 32.89,36.85 v32.69,37.06 | v39.61,39.17 39.73,39.28 ATMEGA128.P$20 | v23.01,46.99 22.73,46.99 20.88,48.84 v18.21,48.84 16.43,47.07 JTAG2.5
  Bottom 0.254: v26.21,46.71 24.87,46.71 24.74,46.58 24.33,46.99 v23.01,46.99 | v29.46,39.34 31.8,37.01 32.64,37.01 v32.69,37.06 | v39.61,39.17 39.73,39.17 39.8,39.09 39.8,38.05 v38.71,36.96 | U$1.6 12.14,54.76 18.06,48.84 v18.21,48.84
TCK
  Top 0.254: ATMEGA128.P$57 42.93,58.24 37.64,63.52 26.01,63.52 20.07,57.58 U$1.1
TDI  (via drill 0.35)
  Top 0.254: v41.12,63.78 41.4,63.78 45.33,59.86 ATMEGA128.P$54 | v38.4,74.5 35.46,77.44 13.33,77.44 7.06,71.17 U$1.9
  Bottom 0.254: v41.12,63.78 41.07,63.78 38.46,66.4 38.46,74.45 v38.4,74.5
TDO  (via drill 0.35)
  Top 0.254: v39.88,63.5 39.88,63.42 44.53,58.78 ATMEGA128.P$55 | v36.93,74.7 34.8,76.83 26.03,76.83 24.46,75.26 24.46,66.57 17.81,59.92 16.48,59.92 14.68,58.12 U$1.3
  Bottom 0.254: v39.88,63.5 36.98,66.4 36.98,74.65 v36.93,74.7
TMS  (via drill 0.35)
  Top 0.254: ATMEGA128.P$56 43.73,58.53 38.1,64.16 23.16,64.16 21.46,62.46 21.46,61.62 v21.34,61.62 | U$1.5 12.14,58.29 15.54,61.7 v17.45,61.7
  Bottom 0.254: v21.34,61.62 17.48,61.62 17.45,61.65 v17.45,61.7
VCC  (via drill 0.35, 0.9)
  Top 0.254: C9.1 46.24,25.45 48.55,25.45 U4.1 | v70.28,51.84 70.28,52.63 70.69,53.03 72.48,53.03 CS2.VCC
  Top 0.762: 35.23,60.35 23.8,60.35 23.09,59.64 v23.09,57.63 | ATMEGA128.P$64 37.33,58.26 35.23,60.35 | 35.23,60.35 35.03,60.55 35.03,61.7 v35.84,62.51 | ATMEGA128.P$52 46.94,55.46 46.94,56.09 50.11,59.26 50.11,64.26 v50.06,64.31 | ATMEGA128.P$21 40.53,38.72 39.91,38.1 32.06,38.1 | CS1.VCC 48.23,27.84 47.85,27.46 45.72,27.46 | 45.72,27.46 44.78,27.46 43.54,26.21 32.74,26.21 | 32.06,38.1 31.55,37.59 31.55,27.41 32.74,26.21 | 32.06,38.1 32.47,38.51 31.7,39.27 31.65,39.27 30.43,40.49 30.43,51.46 R20.1 27.68,52.1 23.09,56.69 v23.09,57.63 | v23.09,57.63 30.32,57.63 C10.1 | U$1.4 16.94,52.78 | 16.94,52.78 20.19,52.78 23.09,55.68 v23.09,57.63 | U$1.7 9.6,61.14 9.07,61.67 v8.53,61.67 | 16.94,52.78 8.25,52.78 v7.9,52.43 7.9,50.72 7.19,50.01 4.78,50.01 3.86,49.1 3.86,43.26 5.36,41.76 6.96,41.76 JTAG2.2 | 45.72,27.46 45.22,26.96 C9.1 | v77.01,39.29 78.51,39.29 79.58,40.36 79.58,49.99 78.51,51.05 v78.41,50.95 | U$3.VCC 63.32,24.6 v63.32,18.59 | v43.87,14.99 40.21,14.99 32.74,22.45 32.74,26.21
  Bottom 0.254: v78.41,50.95 71.4,50.95 70.51,51.84 v70.28,51.84
  Bottom 0.762: v50.06,64.31 49.81,64.06 42.95,64.06 41.43,62.53 35.86,62.53 v35.84,62.51 | v77.01,39.29 64.59,39.29 62,36.7 62,27.64 63.45,26.19 U$3.VCC | v8.53,61.67 5.54,61.67 4.39,60.53 4.39,53.75 5.74,52.4 7.87,52.4 v7.9,52.43 | v63.32,18.59 63.32,13.72 62.33,12.72 55.47,12.72 53.52,14.68 44.17,14.68 v43.87,14.99
VCC1  (via drill 0.35)
  Top 0.254: RSENSE1.2 71.51,48 71.4,48.11 71.4,49.12 71.88,49.61 74.83,49.61 76.56,51.33 76.56,51.99 v76.5,52.05 | v76.53,53.75 75.41,54.87 CS2.RS-
  Top 0.762: R2.2 71.88,66.26 SW4.P$2 70.53,72.14 | 70.53,72.14 70.53,73.67 68.81,75.39 60.96,75.39 58.19,72.62 SW3.P$2 | 70.53,72.14 72,73.61 75.41,73.61 78.97,70.05 78.97,59.94 77.6,58.57 74.27,58.57 | 74.27,58.57 69.48,58.57 68.07,57.17 C16.1 | CS2.RS- 76.05,54.87 76.68,55.5 76.68,56.16 74.27,58.57
  Bottom 0.254: v76.5,52.05 76.43,52.12 76.43,53.65 v76.53,53.75
VOUT1  (via drill 0.35)
  Top 0.254: TPS2.8 19.08,12.19 19.61,12.19 19.86,11.94 19.86,11.43 19.62,11.18 TPS2.2 16.3,11.18 16.05,11.43 16.05,11.68 16.44,12.07 TPS2.1 | v54.81,73.94 53.39,73.94 v50.06,77.27 | v75.29,71.25 76.61,71.25 78.16,69.7 78.16,68.1 77.67,67.61 77.01,67.61 | 77.01,67.61 SW4.P$1 | R5.2 76.23,61.34 76.35,61.21 77.81,62.67 77.81,66.81 77.01,67.61 | CIN6.1 16.09,14.72 14.83,15.98 11.28,15.98 | v5.92,15.98 11.28,15.98 | 11.28,15.98 12.78,17.48 12.78,29.13 10.95,30.95 VIN1.1
  Top 0.762: TPS2.1 17.25,12.14 CIN6.1
  Bottom 0.254: v5.92,15.98 2.39,15.98 1.5,16.87 1.5,73.51 5.95,77.96 49.37,77.96 v50.06,77.27 | v54.81,73.94 70.05,73.94 72.67,71.32 75.21,71.32 v75.29,71.25
VOUT2  (via drill 0.35)
  Top 0.254: v56.77,57.33 56.67,57.43 56.67,60.66 59.91,63.9 59.91,65.81 60.96,66.85 64.8,66.85 66.04,68.1 66.04,69.24 65.46,69.82 SW3.P$1 | R1.2 68.37,60.42 63.68,60.42 62.61,60.42 v61.98,59.79 | v24.64,51.92 v24.64,40.18 | TPS1.8 19.98,28.27 19.98,28.29 20.14,28.45 20.16,28.45 TPS1.2 20.61,28.45 20.63,28.45 20.79,28.29 20.79,28.27 TPS1.1 | v27.43,28.78 27.16,28.5 CIN2.1
  Top 0.762: TPS1.1 21.29,27.77 24.43,27.77 CIN2.1
  Bottom 0.254: v61.98,59.79 59.91,59.79 57.44,57.33 v56.77,57.33 56.77,56.03 54.89,54.15 52.6,54.15 51.84,54.91 51.84,56.19 46.47,61.55 34.28,61.55 33.05,62.79 26.72,62.79 26.29,62.36 26.29,58.4 24.64,56.74 v24.64,51.92 | v24.64,40.18 26.44,38.38 28.5,38.38 29.9,36.98 29.9,29.34 29.41,28.85 27.51,28.85 v27.43,28.78
VVOUT1  (via drill 0.35)
  Top 0.254: R47.2 18.34,3.11 CFF2.1 16.82,5.35 R46.2 14.94,6.35 v15.8,6.35 | v8.41,8.15 8.15,8.41 8.15,9.2 9.31,10.35 9.83,10.35 | 9.83,10.35 L4.2 | 9.83,10.35 9.83,13.01 10.48,13.66 | COUT6.1 10.67,13.66 10.48,13.66 | 10.48,13.66 2.45,13.66 1.34,14.76 1.34,19.13 1.34,40.96 1.4,41.02 1.4,73.33 1.24,73.49 1.23,74.3 2.12,75.18 5.64,75.18 v7.54,73.28
  Bottom 0.254: v15.8,6.35 15.8,7.37 15.29,7.87 8.69,7.87 v8.41,8.15 | v7.54,73.28 11.2,69.62 14.39,69.62 VIN3.1
VVOUT3  (via drill 0.35)
  Top 0.254: v29.24,26.19 29.29,26.24 29.29,33.8 L2.2 29.02,34.74 30.25,35.97 30.25,36.45 28.5,38.2 22.99,38.2 22.46,37.67 22.46,37.41 | R43.2 20.65,35.34 COUT2.1 22.46,37.41 | R44.2 18.86,25.91 CFF1.1 15.29,25.91 15.04,25.65 15.04,21.77 16.1,20.7 26.39,20.7 v26.44,20.75 | v5.11,74.22 5,74.22 2.29,71.5 2.29,41.73 4.27,39.75 20.12,39.75 22.46,37.41
  Bottom 0.254: v26.44,20.75 29.24,23.55 v29.24,26.19 | v5.11,74.22 6.32,75.44 22.56,75.44 23.93,74.07 23.93,70.87 24.84,69.95 VIN4.1
XTAL2
  Top 0.254: 42.09,34.2 38.43,34.2 C11.2 | 42.09,34.2 42.07,34.22 42.43,34.58 42.43,38.77 42.13,39.07 ATMEGA128.P$23 | 42.09,34.2 Q3.2